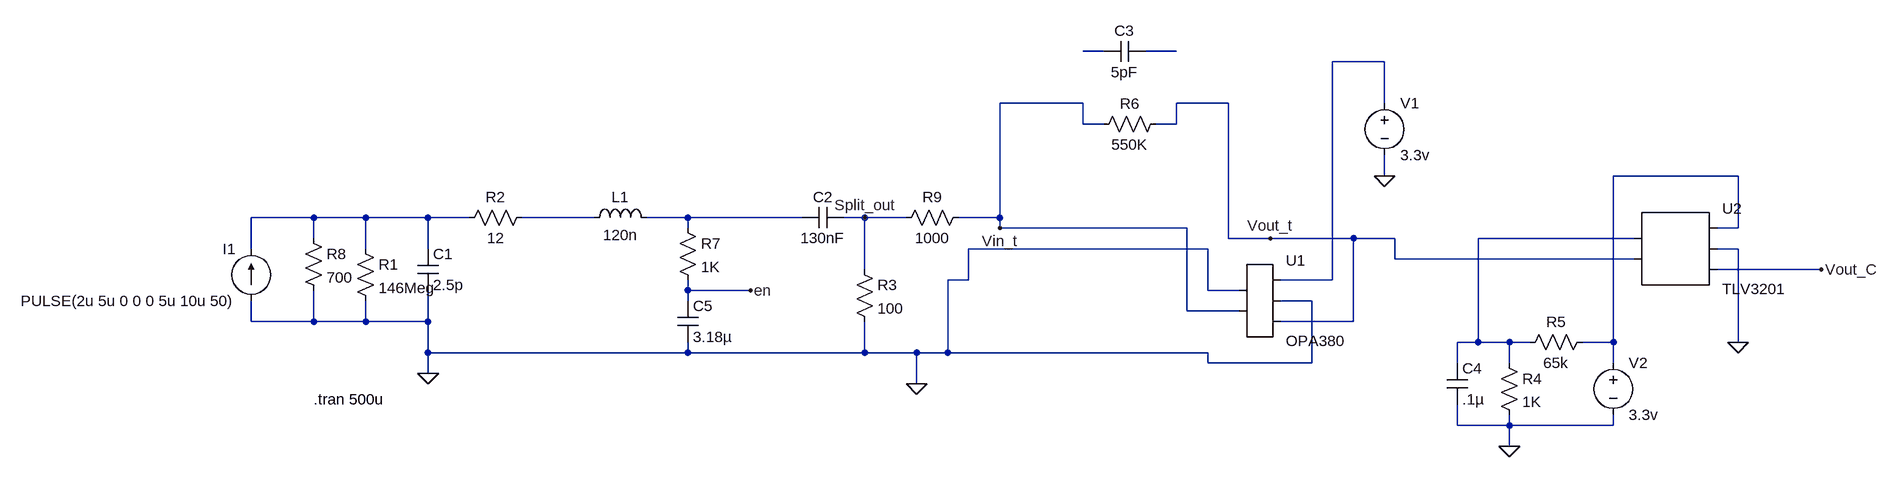
[diagram p0: schematic communication_brunch_2.asc]
communication_brunch_2.asc, the LTspice schematic file:
Version 4
SHEET 1 2080 720
WIRE 880 96 848 96
WIRE 992 96 944 96
WIRE 1312 112 1232 112
WIRE 848 176 720 176
WIRE 1072 176 992 176
WIRE 1312 176 1312 112
WIRE 848 208 848 176
WIRE 880 208 848 208
WIRE 992 208 992 176
WIRE 992 208 960 208
WIRE 1312 288 1312 256
WIRE 1856 288 1664 288
WIRE -336 352 -432 352
WIRE -256 352 -336 352
WIRE -160 352 -256 352
WIRE -96 352 -160 352
WIRE 96 352 -16 352
WIRE 240 352 176 352
WIRE 416 352 240 352
WIRE 512 352 480 352
WIRE 576 352 512 352
WIRE 720 352 720 176
WIRE 720 352 656 352
WIRE 240 368 240 352
WIRE 720 368 720 352
WIRE 1008 368 720 368
WIRE 1856 368 1856 288
WIRE 1856 368 1824 368
WIRE -336 384 -336 352
WIRE 1072 384 1072 176
WIRE 1136 384 1072 384
WIRE 1264 384 1136 384
WIRE 1328 384 1264 384
WIRE 1696 384 1456 384
WIRE -432 400 -432 352
WIRE -256 400 -256 352
WIRE -160 400 -160 352
WIRE 1040 400 672 400
WIRE 1856 400 1824 400
WIRE 1328 416 1328 384
WIRE 1696 416 1328 416
WIRE 512 432 512 352
WIRE 1984 432 1824 432
WIRE 672 448 672 400
WIRE 672 448 640 448
WIRE 1232 448 1232 112
WIRE 1232 448 1152 448
WIRE 240 464 240 448
WIRE 336 464 240 464
WIRE 1040 464 1040 400
WIRE 1088 464 1040 464
WIRE 240 480 240 464
WIRE 1200 480 1152 480
WIRE 1008 496 1008 368
WIRE 1088 496 1008 496
WIRE -432 512 -432 480
WIRE -336 512 -336 464
WIRE -336 512 -432 512
WIRE -256 512 -256 480
WIRE -256 512 -336 512
WIRE -160 512 -160 464
WIRE -160 512 -256 512
WIRE 1264 512 1264 384
WIRE 1264 512 1152 512
WIRE 1456 544 1456 384
WIRE 1456 544 1424 544
WIRE 1504 544 1456 544
WIRE 1536 544 1504 544
WIRE 1664 544 1664 288
WIRE 1664 544 1616 544
WIRE 1856 544 1856 400
WIRE -160 560 -160 512
WIRE 240 560 240 544
WIRE 240 560 -160 560
WIRE 512 560 512 512
WIRE 512 560 240 560
WIRE 592 560 512 560
WIRE 640 560 640 448
WIRE 640 560 592 560
WIRE 1040 560 640 560
WIRE 1040 576 1040 560
WIRE 1200 576 1200 480
WIRE 1200 576 1040 576
WIRE 1424 576 1424 544
WIRE 1504 576 1504 544
WIRE 1664 576 1664 544
WIRE -160 592 -160 560
WIRE 592 608 592 560
WIRE 1424 672 1424 640
WIRE 1504 672 1504 656
WIRE 1504 672 1424 672
WIRE 1664 672 1664 656
WIRE 1664 672 1504 672
WIRE 1504 704 1504 672
FLAG -160 592 0
FLAG 1136 384 Vout_t
FLAG 720 368 Vin_t
FLAG 592 608 0
FLAG 336 464 en
FLAG 512 352 Split_out
FLAG 1312 288 0
FLAG 1856 544 0
FLAG 1504 704 0
FLAG 1984 432 Vout_C
SYMBOL res -272 384 R0
SYMATTR InstName R1
SYMATTR Value 146Meg
SYMBOL cap -176 400 R0
SYMATTR InstName C1
SYMATTR Value 2.5p
SYMBOL res 0 336 R90
WINDOW 0 0 56 VBottom 2
WINDOW 3 32 56 VTop 2
SYMATTR InstName R2
SYMATTR Value 12
SYMBOL current -432 480 R180
WINDOW 3 24 0 Left 2
WINDOW 0 24 80 Left 2
SYMATTR Value PULSE(2u 5u 0 0 0 5u 10u 50)
SYMATTR InstName I1
SYMATTR Value2 AC .5u 0
SYMBOL Cap 480 336 R90
WINDOW 0 0 32 VBottom 2
WINDOW 3 32 32 VTop 2
SYMATTR InstName C2
SYMATTR Value 130nF
SYMBOL ind 80 368 R270
WINDOW 0 32 56 VTop 2
WINDOW 3 5 56 VBottom 2
SYMATTR InstName L1
SYMATTR Value 120n
SYMBOL Res 496 416 R0
SYMATTR InstName R3
SYMATTR Value 100
SYMBOL voltage 1312 160 R0
SYMATTR InstName V1
SYMATTR Value 3.3v
SYMBOL Res 976 192 R90
WINDOW 0 0 56 VBottom 2
WINDOW 3 32 56 VTop 2
SYMATTR InstName R6
SYMATTR Value 550K
SYMBOL AutoGenerated/OPA380 1120 480 R0
SYMATTR InstName U1
SYMBOL Res 224 352 R0
SYMATTR InstName R7
SYMATTR Value 1K
SYMBOL Cap 224 480 R0
SYMATTR InstName C5
SYMATTR Value 3.18µ
SYMBOL Res -352 368 R0
SYMATTR InstName R8
SYMATTR Value 700
SYMBOL Res 672 336 R90
WINDOW 0 0 56 VBottom 2
WINDOW 3 32 56 VTop 2
SYMATTR InstName R9
SYMATTR Value 1000
SYMBOL Cap 944 80 R90
WINDOW 0 0 32 VBottom 2
WINDOW 3 32 32 VTop 2
SYMATTR InstName C3
SYMATTR Value 5pF
SYMBOL AutoGenerated/TLV3201 1760 400 R0
SYMATTR InstName U2
SYMBOL Cap 1408 576 R0
SYMATTR InstName C4
SYMATTR Value .1µ
SYMBOL Res 1488 560 R0
SYMATTR InstName R4
SYMATTR Value 1K
SYMBOL Voltage 1664 560 R0
SYMATTR InstName V2
SYMATTR Value 3.3v
SYMBOL Res 1632 528 R90
WINDOW 0 0 56 VBottom 2
WINDOW 3 32 56 VTop 2
SYMATTR InstName R5
SYMATTR Value 65k
TEXT -336 632 Left 2 !.tran 500u

The netlist it stands for:
* communication_brunch_2.asc
R1 N005 0 146Meg
C1 N005 0 2.5p
R2 N006 N005 12
I1 0 N005 PULSE(2u 5u 0 0 0 5u 10u 50) AC .5u 0
C2 Split_out N007 130nF
L1 N006 N007 120n
R3 Split_out 0 100
V1 N003 0 3.3v
R6 Vout_t Vin_t 550K
* U1: OPA380 (symbol AutoGenerated/OPA380 not available, pins judged from their places): pin1=0 pin2=Vin_t pin3=N003 pin4=0 pin5=Vout_t
R7 N007 en 1K
C5 en 0 3.18µ
R8 N005 0 700
R9 Vin_t Split_out 1000
C3 N002 N001 5pF
* U2: TLV3201 (symbol AutoGenerated/TLV3201 not available, pins judged from their places): pin1=N008 pin2=Vout_t pin3=N004 pin4=0 pin5=Vout_C
C4 N008 0 .1µ
R4 N008 0 1K
V2 N004 0 3.3v
R5 N004 N008 65k
.tran 500u
.backanno
.end